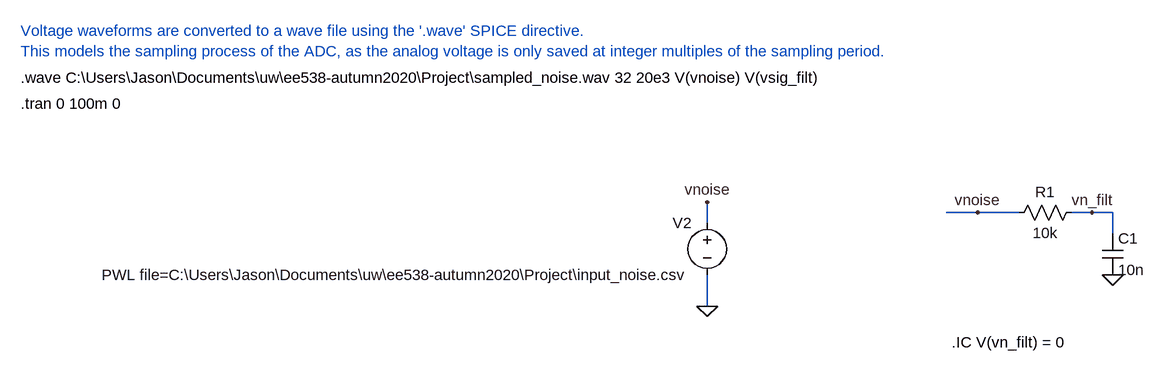
[diagram p0: schematic noise_sampling_method2.asc]
noise_sampling_method2.asc, the LTspice schematic file:
Version 4
SHEET 1 1520 696
WIRE 496 96 448 96
WIRE 560 96 496 96
WIRE 672 96 640 96
WIRE 704 96 672 96
WIRE 80 112 80 80
WIRE 704 128 704 96
WIRE 80 240 80 192
FLAG 80 80 vnoise
FLAG 80 240 0
FLAG 704 192 0
FLAG 672 96 vn_filt
FLAG 496 96 vnoise
SYMBOL voltage 80 96 M0
WINDOW 123 0 0 Left 0
WINDOW 39 0 0 Left 0
SYMATTR InstName V2
SYMATTR Value PWL file=C:\Users\Jason\Documents\uw\ee538-autumn2020\Project\input_noise.csv
SYMBOL cap 688 128 R0
SYMATTR InstName C1
SYMATTR Value 10n
SYMBOL res 656 80 R90
WINDOW 0 0 56 VBottom 2
WINDOW 3 32 56 VTop 2
SYMATTR InstName R1
SYMATTR Value 10k
TEXT -976 -112 Left 2 !.wave C:\\Users\\Jason\\Documents\\uw\\ee538-autumn2020\\Project\\sampled_noise.wav 32 20e3 V(vnoise) V(vsig_filt)
TEXT -976 -72 Left 2 !.tran 0 100m 0
TEXT 456 296 Left 2 !.IC V(vn_filt) = 0
TEXT -976 -184 Left 2 ;Voltage waveforms are converted to a wave file using the '.wave' SPICE directive. \nThis models the sampling process of the ADC, as the analog voltage is only saved at integer multiples of the sampling period.

The netlist it stands for:
* noise_sampling_method2.asc
V2 vnoise 0 PWL file=C:\Users\Jason\Documents\uw\ee538-autumn2020\Project\input_noise.csv
C1 vn_filt 0 10n
R1 vn_filt vnoise 10k
.wave C:\Users\Jason\Documents\uw\ee538-autumn2020\Project\sampled_noise.wav 32 20e3 V(vnoise) V(vsig_filt)
.tran 0 100m 0
.IC V(vn_filt) = 0
* Voltage waveforms are converted to a wave file using the '.wave' SPICE directive.
* This models the sampling process of the ADC, as the analog voltage is only saved at integer multiples of the sampling period.
.backanno
.end